# EAGLE schematic board (EAGLE 9.4.2)
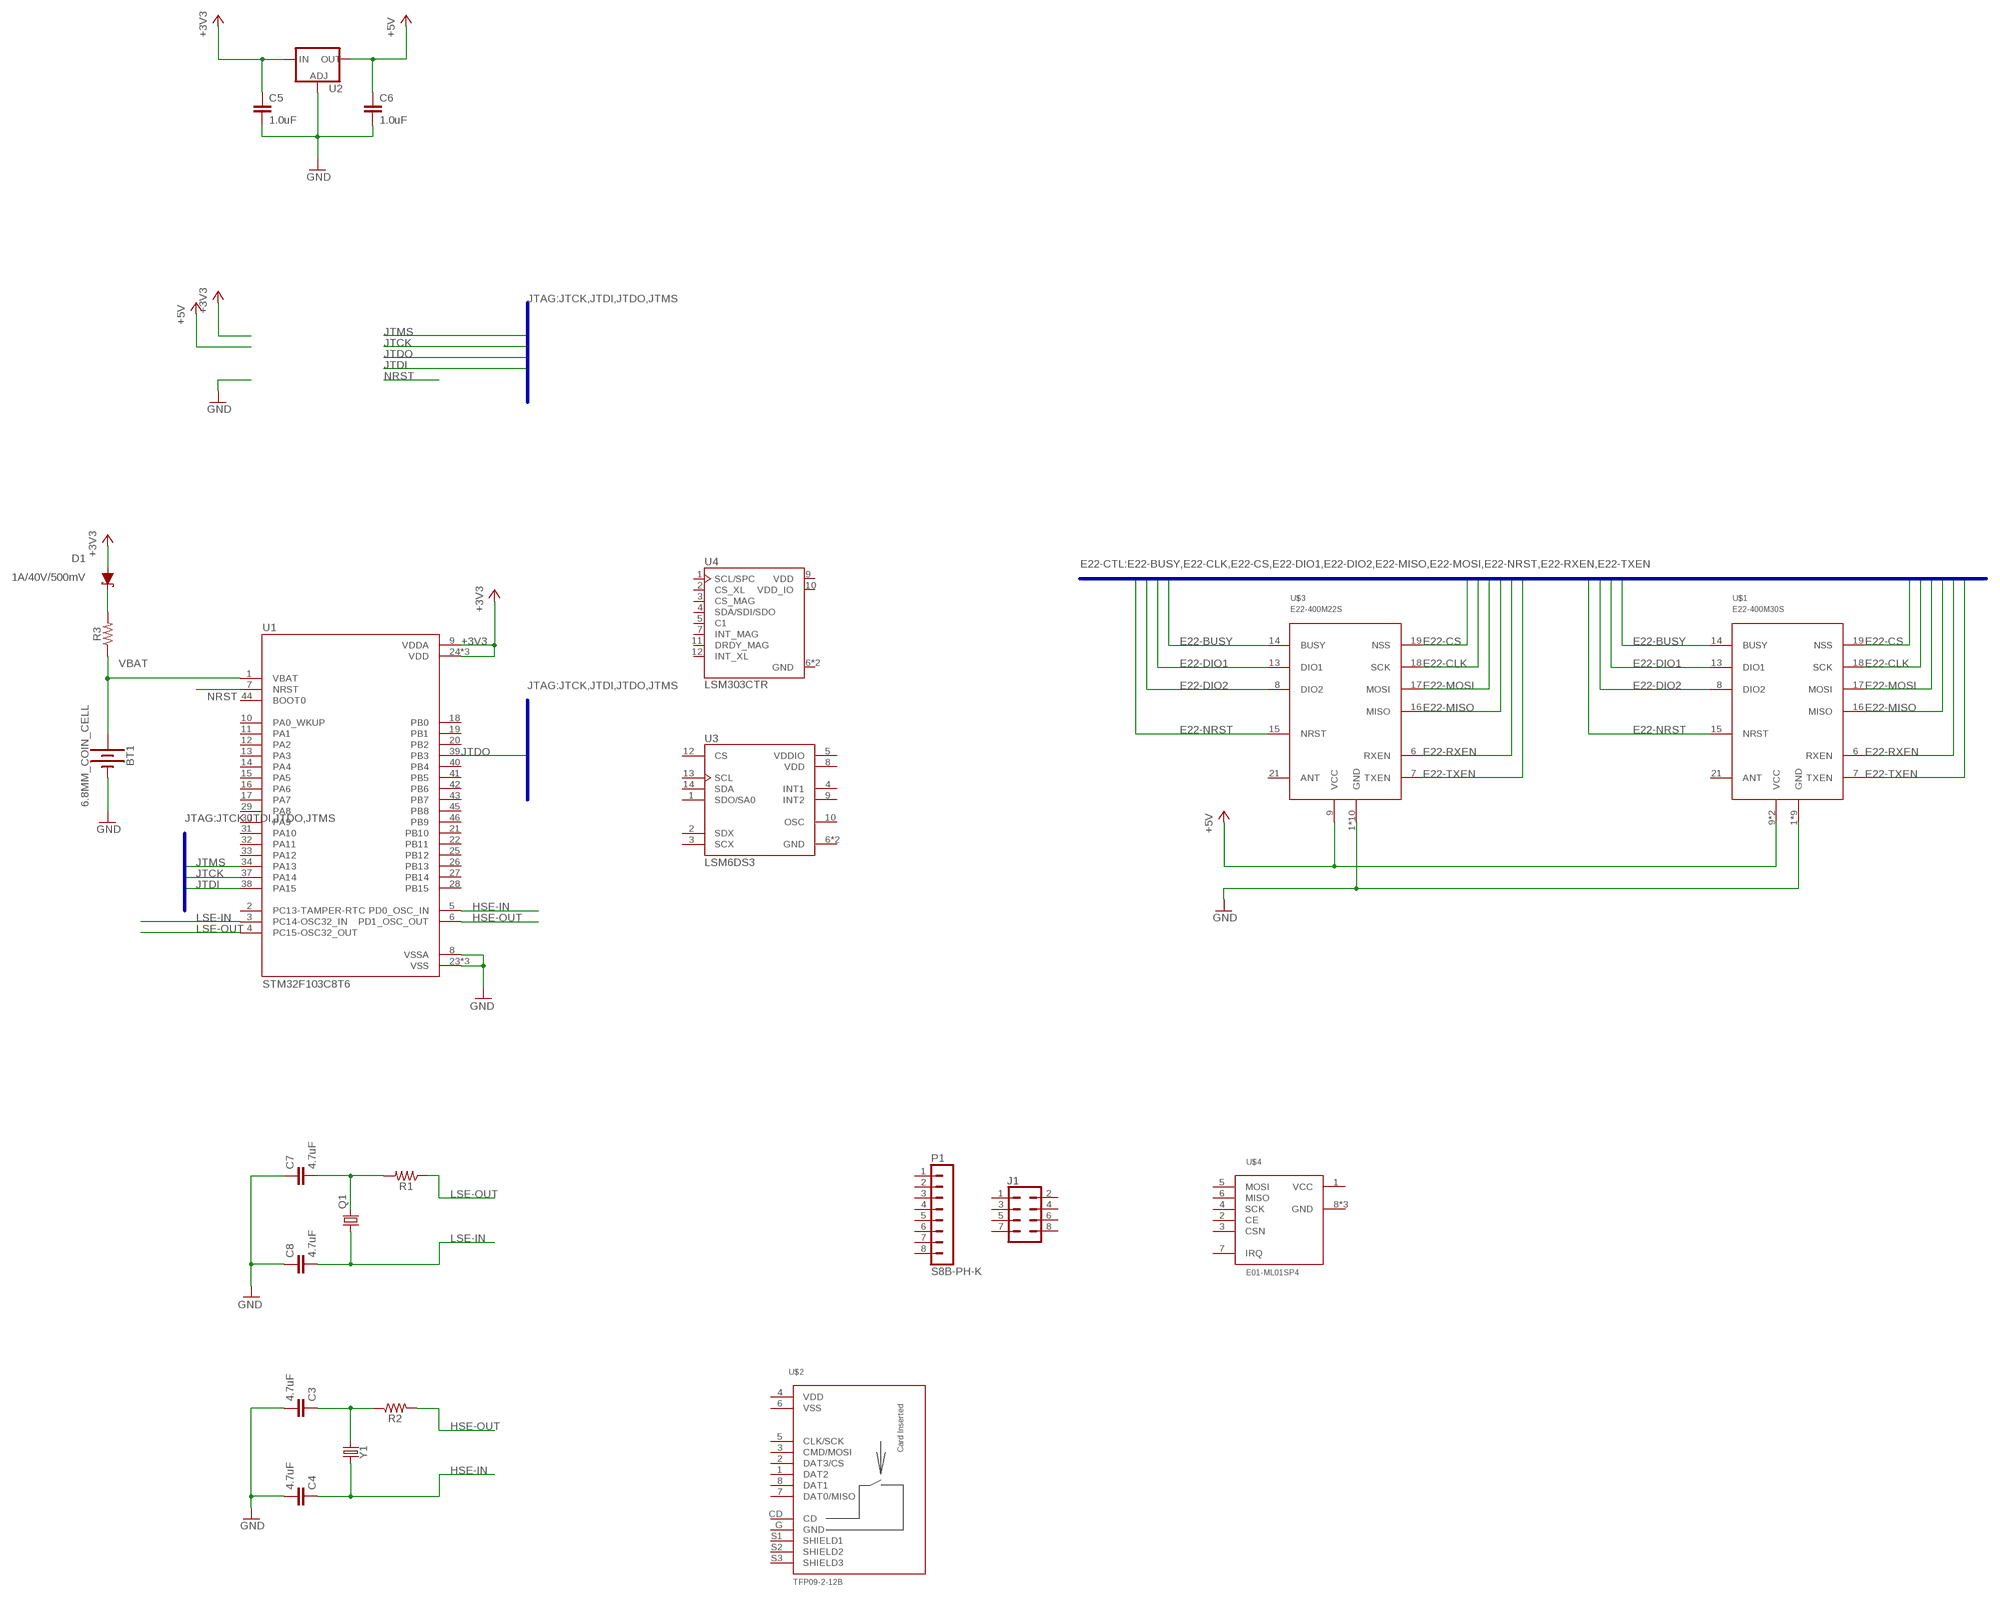
[diagram p0: schematic, sheet 1]

## Parts
BT1  6.8MM_COIN_CELL  BATTERY-6.8MM_SMD  [BATTCON-6.8MM]
C3  4.7uF  4.7UF-0603-35V-(20%)  [0603]
C4  4.7uF  4.7UF-0603-35V-(20%)  [0603]
C5  1.0uF  1.0UF-0805-25V-10%  [0805]
C6  1.0uF  1.0UF-0805-25V-10%  [0805]
C7  4.7uF  4.7UF-0603-35V-(20%)  [0603]
C8  4.7uF  4.7UF-0603-35V-(20%)  [0603]
D1  1A/40V/500mV  DIODE-SCHOTTKY-SS14  [SMA-DIODE]
J1  CONN_04X2  [2X4]
P1  S8B-PH-K  [S8B-PH-K]
Q1  CRYSTALMM20SS  [MM20SS]
R1  RESISTOR0603  [0603]
R2  RESISTOR0603  [0603]
R3  RESISTOR0603  [0603]
U1  STM32F103C8T6  [QFP50P900X900X160-48N]
U2  V_REG_LM1117SOT223  [SOT223]
U3  LSM6DS3  [PQFN50P300X250X86-14N]
U4  LSM303CTR  [LGA12R50P_200X200X100]
U$1  E22-400M30S  [E22-400M30S]
U$2  TFP09-2-12B  [TFP09-2-12B]
U$3  E22-400M22S  [E22-400M22S]
U$4  E01-ML01SP4  [E01-ML01SP4]
Y1  CRYSTALPTH-HC49US  [HC49US]

## Nets
+3V3: C5.1 D1.A U1.9(VDDA) U1.24(VDD) U1.36(VDD) U1.48(VDD) U2.3(IN)
+5V: C6.1 U2.2(OUT) U2.4(OUT) U$1.9(VCC) U$1.10(VCC) U$3.9(VCC)
E22-BUSY: U$1.14(BUSY) U$3.14(BUSY)
E22-CLK: U$1.18(SCK) U$3.18(SCK)
E22-CS: U$1.19(NSS) U$3.19(NSS)
E22-DIO1: U$1.13(DIO1) U$3.13(DIO1)
E22-DIO2: U$1.8(DIO2) U$3.8(DIO2)
E22-MISO: U$1.16(MISO) U$3.16(MISO)
E22-MOSI: U$1.17(MOSI) U$3.17(MOSI)
E22-NRST: U$1.15(NRST) U$3.15(NRST)
E22-RXEN: U$1.6(RXEN) U$3.6(RXEN)
E22-TXEN: U$1.7(TXEN) U$3.7(TXEN)
GND: BT1.- C3.2 C4.2 C5.2 C6.2 C7.1 C8.1 U1.8(VSSA) U1.23(VSS) U1.35(VSS) U1.47(VSS) U2.1(ADJ) U$1.1(GND) U$1.2(GND) U$1.3(GND) U$1.4(GND) U$1.5(GND) U$1.11(GND) U$1.12(GND) U$1.20(GND) U$1.22(GND) U$3.1(GND) U$3.2(GND) U$3.3(GND) U$3.4(GND) U$3.5(GND) U$3.10(GND) U$3.11(GND) U$3.12(GND) U$3.20(GND) U$3.22(GND)
HSE-IN: C4.1 U1.5(PD0_OSC_IN) Y1.1
HSE-OUT: R2.2 U1.6(PD1_OSC_OUT)
JTCK: U1.37(PA14)
JTDI: U1.38(PA15)
JTDO: U1.39(PB3)
JTMS: U1.34(PA13)
LSE-IN: C8.2 Q1.1 U1.3(PC14-OSC32_IN)
LSE-OUT: R1.1 U1.4(PC15-OSC32_OUT)
N$7: D1.C R3.2
N$8: C7.2 Q1.4 R1.2
N$9: C3.1 R2.1 Y1.2
NRST: U1.7(NRST)
VBAT: BT1.+ R3.1 U1.1(VBAT)
Unconnected: J1.1 J1.2 J1.3 J1.4 J1.5 J1.6 J1.7 J1.8 P1.1 P1.2 P1.3 P1.4 P1.5 P1.6 P1.7 P1.8 U1.2(PC13-TAMPER-RTC) U1.10(PA0_WKUP) U1.11(PA1) U1.12(PA2) U1.13(PA3) U1.14(PA4) U1.15(PA5) U1.16(PA6) U1.17(PA7) U1.18(PB0) U1.19(PB1) U1.20(PB2) U1.21(PB10) U1.22(PB11) U1.25(PB12) U1.26(PB13) U1.27(PB14) U1.28(PB15) U1.29(PA8) U1.30(PA9) U1.31(PA10) U1.32(PA11) U1.33(PA12) U1.40(PB4) U1.41(PB5) U1.42(PB6) U1.43(PB7) U1.44(BOOT0) U1.45(PB8) U1.46(PB9) U3.1(SDO/SA0) U3.2(SDX) U3.3(SCX) U3.4(INT1) U3.9(INT2) U3.10(OSC) U3.12(CS) U3.13(SCL) U3.14(SDA) U4.1(SCL/SPC) U4.2(CS_XL) U4.3(CS_MAG) U4.4(SDA/SDI/SDO) U4.5(C1) U4.7(INT_MAG) U4.11(DRDY_MAG) U4.12(INT_XL) U$1.21(ANT) U$2.1(DAT2) U$2.2(DAT3/CS) U$2.3(CMD/MOSI) U$2.4(VDD) U$2.5(CLK/SCK) U$2.6(VSS) U$2.7(DAT0/MISO) U$2.8(DAT1) U$2.CD U$2.G(GND) U$2.S1(SHIELD1) U$2.S2(SHIELD2) U$2.S3(SHIELD3) U$3.21(ANT) U$4.2(CE) U$4.3(CSN) U$4.4(SCK) U$4.5(MOSI) U$4.6(MISO) U$4.7(IRQ)

## Buses
JTAG:JTCK,JTDI,JTDO,JTMS
E22-CTL:E22-BUSY,E22-CLK,E22-CS,E22-DIO1,E22-DIO2,E22-MISO,E22-MOSI,E22-NRST,E22-RXEN,E22-TXEN

## Power pins joined to a net without a drawn wire
GND: U3.6(GND) U3.7(GND) U4.6(GND) U4.8(GND) U$4.8(GND) U$4.9(GND) U$4.10(GND)
VCC: U$4.1(VCC)
VDD: U3.8(VDD) U4.9(VDD)
VDD_IO: U4.10(VDD_IO)
VDDIO: U3.5(VDDIO)

## Library data of the parts
BT1 = SparkFun-Batteries:BATTERY: Battery - Single Cell A variety of battery chemistries, sizes, and footprints. Device List: 20MM_PTH - Coin Cell Battery Holder - 20mm (PTH) <https://www.sparkfun.com/products/783> 20MM_PTH_KIT- Coin Cell battery Holder - 20 mm (PTH) <http://www.sparkfun.com/products/783>kit version with special mask 6.8MM_PTH - Coin Cell Battery Holder - 6.8MM(SMD) <https://www.digikey.com/product-detail/en/seiko-instruments/MS621FE-FL11E/728-1057-ND/1889208?WT.srch=1&gclid=CNOQ5a6LzdQCFZS2wAodXCkE0g> 12MM_SMD - Coin Cell Battery Holder - 12mm (SMD) <https://www.sparkfun.com/products/10592> 12MM_PTH - Coin Cell Battery Holder - 12mm (PTH) <https://www.sparkfun.com/products/7948> 20MM_SMD - 20mm Coin Cell Battery Holder (SMD) (2 legs) Used on the Big Time Watch Kit <https://www.sparkfun.com/products/11734> 20MM_SMD_4LEGS - Coin Cell Battery Holder - 20mm (SMD) <https://www.sparkfun.com/products/11892> 20MM_SMD_4LEGS_OVERPASTE - Coin Cell Battery Holder - 20mm (SMD) <https://www.sparkfun.com/products/11892> (Over-paste on the legs) 24.5MM_PTH - Coin Cell Battery Holder - 24.5mm (PTH) <https://www.sparkfun.com/products/8863> 9V - 9V Battery Holder - PC Mount Used on the SparkFun SparkPunk Sound Kit <https://www.sparkfun.com/products/11177> and SparkFun SparkPunk Sequencer Kit <https://www.sparkfun.com/products/12707> 18650 - Battery Holder - 18650 (PTH) <https://www.sparkfun.com/products/13113> AA - Battery Holder - 1xAA (PTH) <https://www.sparkfun.com/products/7949> AAA - Battery Holder - 1xAAA (PTH) <https://www.sparkfun.com/products/12718> AA_KIT - Battery Holder - 1xAA (PTH) <https://www.sparkfun.com/products/7949> Special kit package - pads only have exposed copper on one side of the board. AAA_KIT - Battery Holder - 1xAAA (PTH) <https://www.sparkfun.com/products/12718> Special kit package - pads only have exposed copper on one side of the board.; PROD_ID: BATT-13734
C3 C4 C7 C8 = SparkFun-Capacitors:4.7UF: 4.7µF ceramic capacitors A capacitor is a passive two-terminal electrical component used to store electrical energy temporarily in an electric field.; PROD_ID: CAP-14106
C5 C6 = SparkFun-Capacitors:1.0UF: 1µF ceramic capacitors A capacitor is a passive two-terminal electrical component used to store electrical energy temporarily in an electric field.; PROD_ID: CAP-08064
D1 = SparkFun-DiscreteSemi:DIODE-SCHOTTKY: Schottky diode A Schottky diode is a semiconductor diode which has a low forward voltage drop and a very fast switching action.; PROD_ID: DIO-08053
J1 = SparkFun-Connectors:CONN_04X2: Multi connection point. Often used as Generic Header-pin footprint for 0.1 inch spaced/style header connections On any of the 0.1 inch spaced packages, you can populate with these: Break Away Headers - Straight <https://www.sparkfun.com/products/116> (PRT-00116) Break Away Male Headers - Right Angle <https://www.sparkfun.com/products/553> (PRT-00553) Female Headers <https://www.sparkfun.com/products/115> (PRT-00115) Break Away Headers - Machine Pin <https://www.sparkfun.com/products/117> (PRT-00117) Break Away Female Headers - Swiss Machine Pin <https://www.sparkfun.com/products/743> (PRT-00743)
P1 = con-jst-ph:S8B-PH-K: HEADER
Q1 = crystal:CRYSTAL: CRYSTAL; OC_FARNELL: unknown; OC_NEWARK: unknown
R1-R3 = SparkFun-Resistors:RESISTOR: Generic Resistor Package
U1 = STM32F103C8T6:STM32F103C8T6: Mainstream Performance line, ARM Cortex-M3 MCU with 64 Kbytes Flash, 72 MHz CPU, motor control, USB and CAN; AVAILABILITY: Unavailable; DESCRIPTION: Mainstream Performance line, ARM Cortex-M3 MCU with 64 Kbytes Flash, 72 MHz CPU, motor control, USB and CAN; MF: STMicroelectronics; MP: STM32F103C8T6; PACKAGE: LQFP-48 STMicroelectronics; PRICE: None
U2 = SparkFun-IC-Power:V_REG_LM1117: Voltage Regulator LM1117 Standard adjustable voltage regulator but in SMD form. Spark Fun Electronics SKU : COM-00595; PROD_ID: VREG-08170
U3 = LSM6DS3:LSM6DS3: iNEMO inertial module: 3D accelerometer and 3D gyroscope; AVAILABILITY: Unavailable; DESCRIPTION: iNEMO inertial module: 3D accelerometer and 3D gyroscope; MF: STMicroelectronics; MP: LSM6DS3; PACKAGE: LGA-14 STMicroelectronics; PRICE: None
U4 = LSM303CTR:LSM303CTR: Accelerometer Triple Â±2g/Â±4g/Â±8g/Â±16g 1.9V to 3.6V 12-Pin LGA T/R; AVAILABILITY: Unavailable; DESCRIPTION: MEMS Module, Tri-Axis Accelerometer, Tri-Axis Magnetometer, 2g, 4g, 8g, 16g, LGA, 12, 1.9 V; MF: STMicroelectronics; MP: LSM303CTR; PACKAGE: LGA-12 STMicroelectronics; PRICE: None
U$1 = ebyte-radio:E22-400M30S: EBYTE E22400M30S radio module Datasheet and info: http://www.ebyte.com/en/product-view-news.aspx?id=454
U$2 = sdcard:TFP09-2-12B: Слот для SD карты TFP-09-2-12B Datasheet: http://images.100y.com.tw/pdf_file/10-TFP09-2-12B.pdf
U$3 = ebyte-radio:E22-400M22S: EBYTE E22400M22S radio module Datasheet and info: http://www.ebyte.com/en/product-view-news.aspx?id=436
U$4 = ebyte-radio:E01-ML01SP4: EBYTE E01-ML01SP4 radio module Datasheet and info: http://www.ebyte.com/en/product-view-news.aspx?id=114
Y1 = SparkFun-Clocks:CRYSTAL: Crystals (Generic) These are passive quartz crystals, which can be used as a clock source for a microcontroller. Crystal's are two-terminal devices. They require external "load" capacitors to generate an oscillating signal.